# EAGLE design e14 (EAGLE 9.6.2)
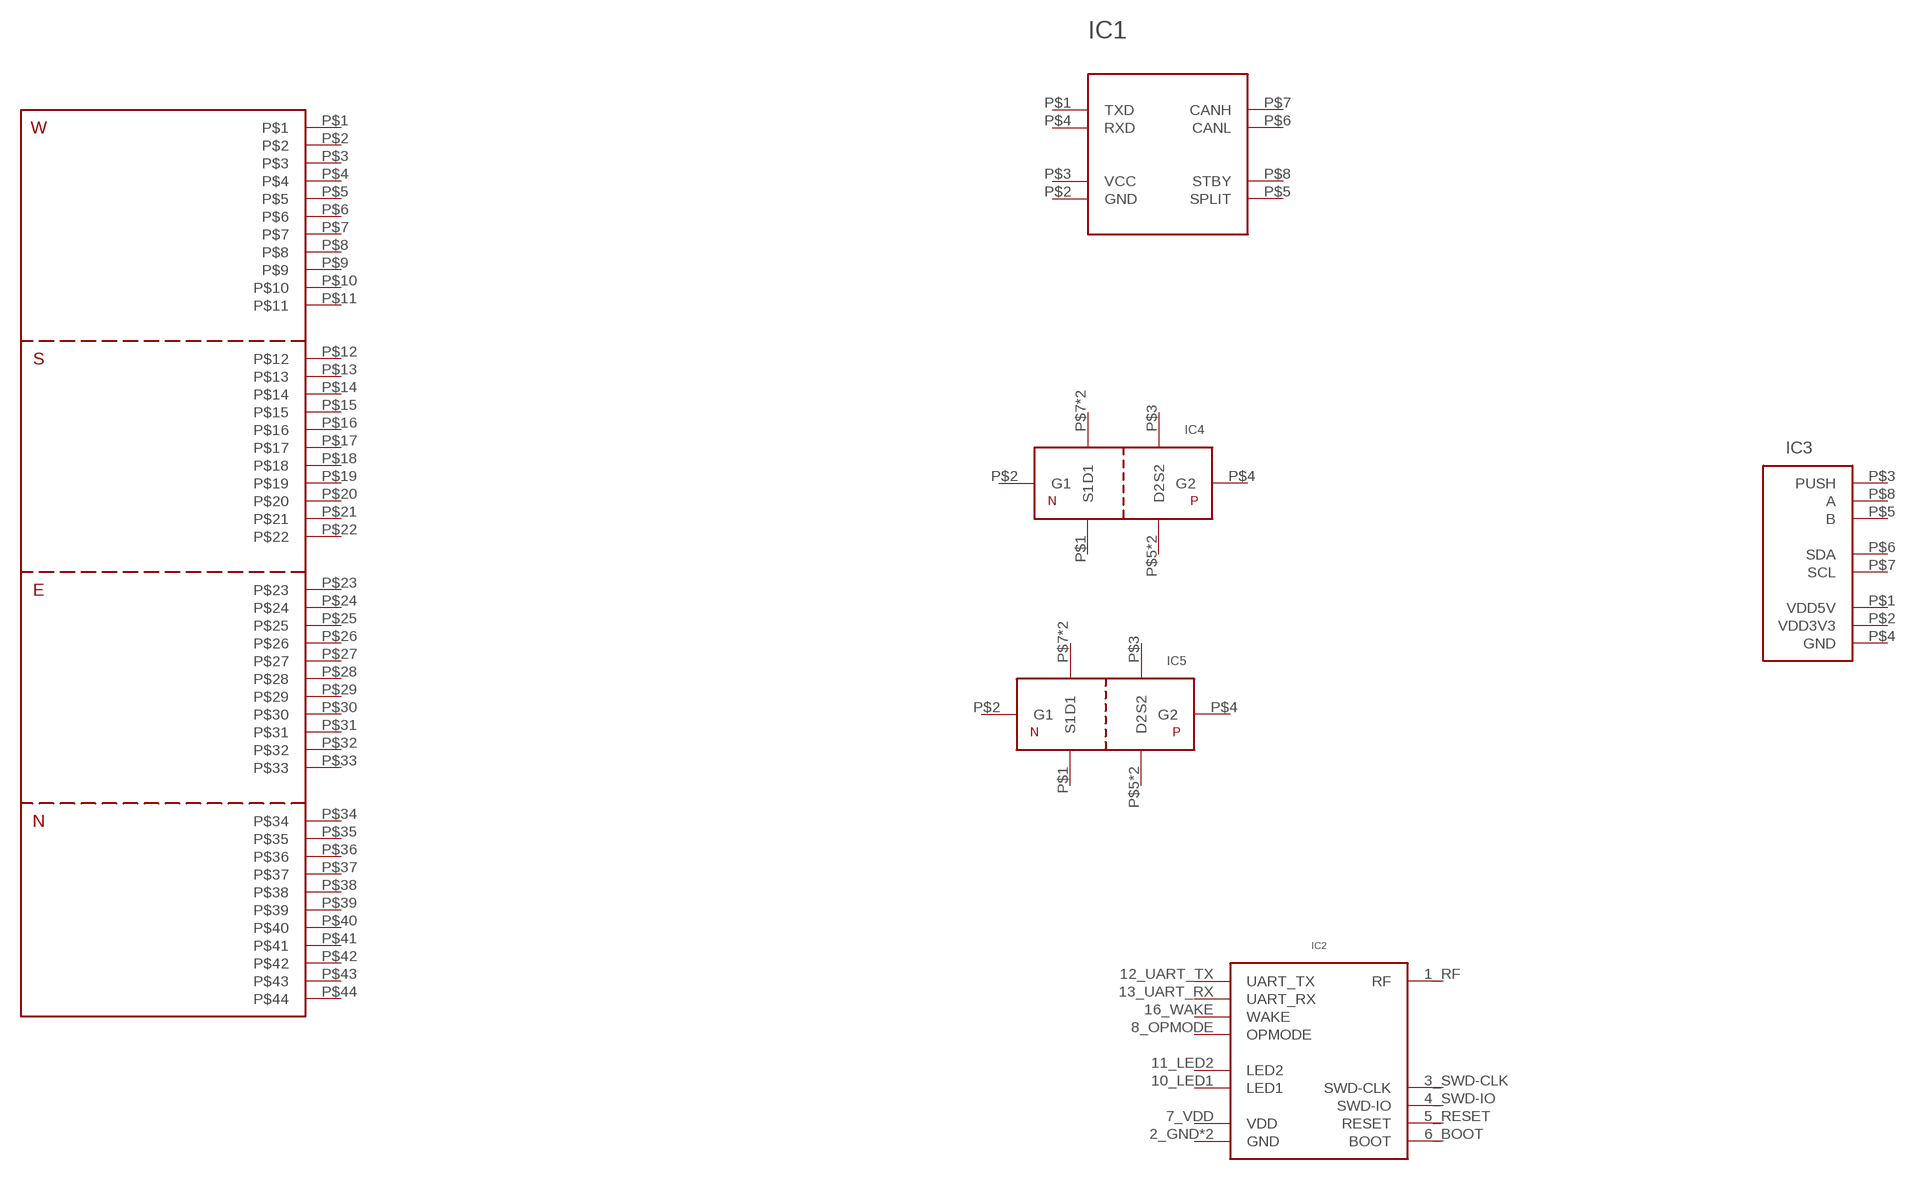
[diagram p0: schematic, sheet 1]

## Parts
IC1  MCP2561-2SOIC  [SOIC]
IC2  AMB2621  [SMD]
IC3  AS5601  [SOIC8]
IC4  4559A  [SO-8]
IC5  4559A  [SO-8]
IC6  PIC33  [QFN44]
Unconnected: IC1.P$1(TXD) IC1.P$4(RXD) IC1.P$5(SPLIT) IC1.P$6(CANL) IC1.P$7(CANH) IC1.P$8(STBY) IC2.1_RF(RF) IC2.3_SWD-CLK(SWD-CLK) IC2.4_SWD-IO(SWD-IO) IC2.5_RESET(RESET) IC2.6_BOOT(BOOT) IC2.8_OPMODE(OPMODE) IC2.10_LED1(LED1) IC2.11_LED2(LED2) IC2.12_UART_TX(UART_TX) IC2.13_UART_RX(UART_RX) IC2.16_WAKE(WAKE) IC3.P$3(PUSH) IC3.P$5(B) IC3.P$6(SDA) IC3.P$7(SCL) IC3.P$8(A) IC4.P$1(S1) IC4.P$2(G1) IC4.P$3(S2) IC4.P$4(G2) IC4.P$5(D2) IC4.P$6(D2) IC4.P$7(D1) IC4.P$8(D1) IC5.P$1(S1) IC5.P$2(G1) IC5.P$3(S2) IC5.P$4(G2) IC5.P$5(D2) IC5.P$6(D2) IC5.P$7(D1) IC5.P$8(D1) IC6.P$1 IC6.P$2 IC6.P$3 IC6.P$4 IC6.P$5 IC6.P$6 IC6.P$7 IC6.P$8 IC6.P$9 IC6.P$10 IC6.P$11 IC6.P$12 IC6.P$13 IC6.P$14 IC6.P$15 IC6.P$16 IC6.P$17 IC6.P$18 IC6.P$19 IC6.P$20 IC6.P$21 IC6.P$22 IC6.P$23 IC6.P$24 IC6.P$25 IC6.P$26 IC6.P$27 IC6.P$28 IC6.P$29 IC6.P$30 IC6.P$31 IC6.P$32 IC6.P$33 IC6.P$34 IC6.P$35 IC6.P$36 IC6.P$37 IC6.P$38 IC6.P$39 IC6.P$40 IC6.P$41 IC6.P$42 IC6.P$43 IC6.P$44

## Power pins joined to a net without a drawn wire
GND: IC1.P$2(GND) IC2.2_GND(GND) IC2.17_GND(GND) IC3.P$4(GND)
VCC: IC1.P$3(VCC)
VDD: IC2.7_VDD(VDD)
VDD3V3: IC3.P$2(VDD3V3)
VDD5V: IC3.P$1(VDD5V)

## Library data of the parts
IC1 = MCP2561-2 - High-Speed CAN Transceiver:MCP2561-2
IC2 = AMB2621 - BLE Module:AMB2621
IC3 = AS5601 - Programmable Contactless Encoder:AS5601
IC4 IC5 = 4559A - PN Fet:4559A
IC6 = PIC33:PIC33

## Net classes
2 Vcc: width 0.25 mm, drill 0.25 mm, clearance 0.25 mm

## Board
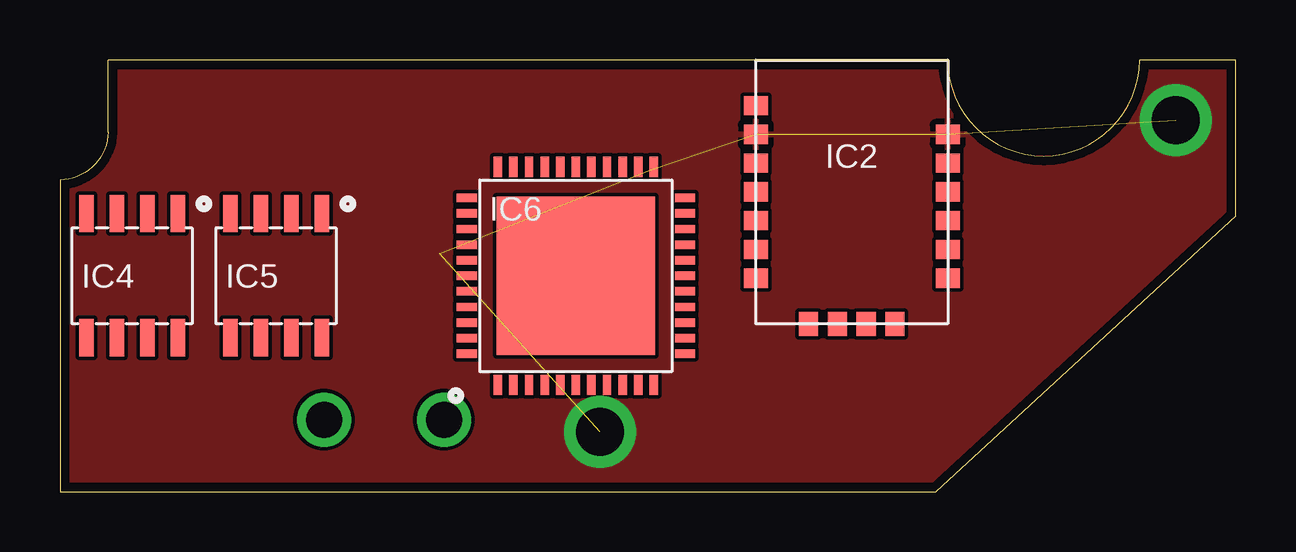
[diagram p1: board, top side]
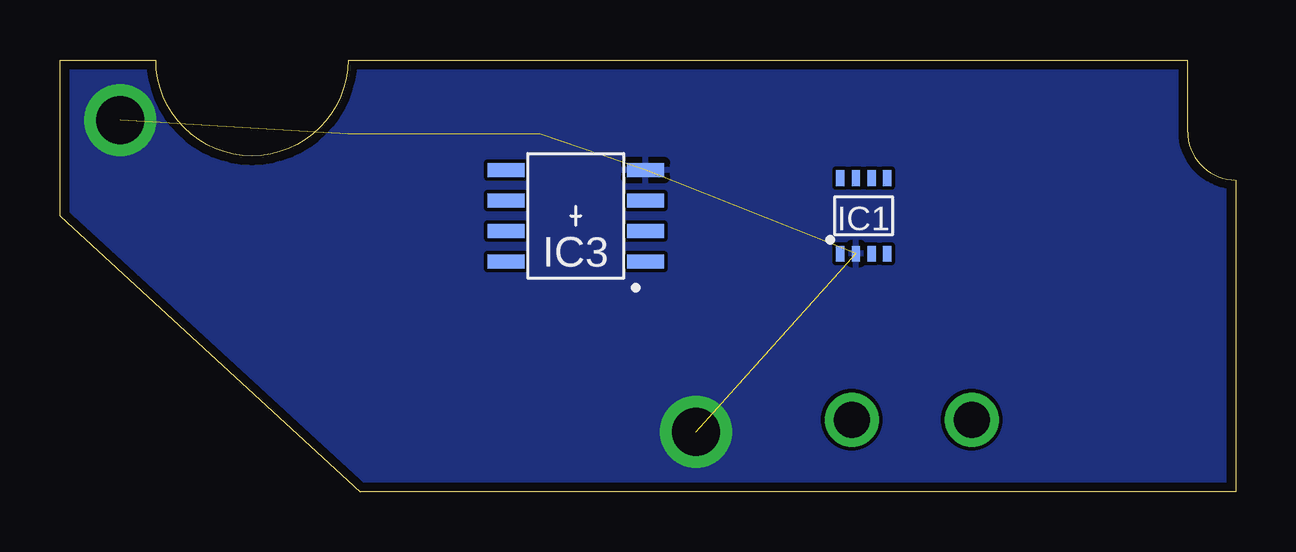
[diagram p2: board, bottom side, seen from below]

Size 49 x 18 mm. Coordinates in mm from the lower left corner, seen from the top.
Outline: 0,0 36.5,0 49,11.5 49,18 45,18 arc-180 37,18 2,18 2,15 arc-90 0,13 0,0
Copper layers (1*16): Top 0.035559375mm / dielectric 1.6mm / Bottom 0.035559375mm
Design rules "oshpark-2layer": minimum track width 6mil, minimum drill 10mil, track to track 6mil, track to pad 6mil, pad to pad 6mil, via to via 6mil, smd to smd 6mil, copper to edge 15mil, drill to drill 6mil, minimum pad ring 5mil, minimum via ring 5mil, stop-mask expansion 2.5mil, vias tented up to drill 0mil, thermal gap 10mil

### Footprints (pad centres in the part's own frame; a part is rotated, then mirrored left to right if it is on the bottom)
SOIC = smd 0.35 x 0.65: P$1 -0.975,-1.575; P$2 -0.325,-1.575; P$3 0.325,-1.575; P$4 0.975,-1.575; P$5 0.975,1.575; P$6 0.325,1.575; P$7 -0.325,1.575; P$8 -0.975,1.575
SMD = smd 1 x 0.8: 1_RF -4,4.1; 2_GND -4,2.9; 3_SWD-CLK -4,1.7; 4_SWD-IO -4,0.5; 5_RESET -4,-0.7; 6_BOOT -4,-1.9; 7_VDD -4,-3.1; 12_UART_TX 4,-3.1; 13_UART_RX 4,-1.9; 14_RESERVED 4,-0.7; 15_RESERVED 4,0.5; 16_WAKE 4,1.7; 17_GND 4,2.9 | smd 0.8 x 1: 8_OPMODE -1.8,-5; 9_RESERVED -0.6,-5; 10_LED1 0.6,-5; 11_LED2 1.8,-5
SOIC8 = smd 0.6 x 1.55: P$1 -1.905,-2.91; P$2 -0.635,-2.91; P$3 0.635,-2.91; P$4 1.905,-2.91; P$5 1.905,2.91; P$6 0.635,2.91; P$7 -0.635,2.91; P$8 -1.905,2.91
SO-8 = smd 0.6 x 1.55: P$1 -1.92,-2.6; P$2 -0.65,-2.6; P$3 0.62,-2.6; P$4 1.89,-2.6; P$5 1.89,2.58; P$6 0.62,2.58; P$7 -0.65,2.58; P$8 -1.92,2.58
QFN44 = smd 0.85 x 0.35: P$1 -4.55,3.25; P$2 -4.55,2.6; P$3 -4.55,1.95; P$4 -4.55,1.3; P$5 -4.55,0.65; P$6 -4.55,0; P$7 -4.55,-0.65; P$8 -4.55,-1.3; P$9 -4.55,-1.95; P$10 -4.55,-2.6; P$11 -4.55,-3.25; P$23 4.55,-3.25; P$24 4.55,-2.6; P$25 4.55,-1.95; P$26 4.55,-1.3; P$27 4.55,-0.65; P$28 4.55,0; P$29 4.55,0.65; P$30 4.55,1.3; P$31 4.55,1.95; P$32 4.55,2.6; P$33 4.55,3.25 | smd 0.35 x 0.85: P$12 -3.25,-4.55; P$13 -2.6,-4.55; P$14 -1.95,-4.55; P$15 -1.3,-4.55; P$16 -0.65,-4.55; P$17 0,-4.55; P$18 0.65,-4.55; P$19 1.3,-4.55; P$20 1.95,-4.55; P$21 2.6,-4.55; P$22 3.25,-4.55; P$34 3.25,4.55; P$35 2.6,4.55; P$36 1.95,4.55; P$37 1.3,4.55; P$38 0.65,4.55; P$39 0,4.55; P$40 -0.65,4.55; P$41 -1.3,4.55; P$42 -1.95,4.55; P$43 -2.6,4.55; P$44 -3.25,4.55 | smd 6.6 x 6.6: P$45 0,0

### Placement (x,y rotation side)
IC1  15.5,11.5 0 bottom
IC2  33,12 0 top
IC3  27.5,11.5 90 bottom
IC4  3,9 180 top
IC5  9,9 180 top
IC6  21.5,9 90 top

### Tracks (layer width: path | path; a pad name or v marks a point on that pad's centre or on a via)
GND  (via drill 2)  (5 unrouted)
  other vias: 22.5,2.5 46.5,15.5
  pour Top: -1,-1 50,-1 50,19 -1,19
  pour Bottom: -1,-1 50,-1 50,19 -1,19
MOTOR+  (via drill 1.5)
  other vias: 11,3
MOTOR-  (via drill 1.5)
  other vias: 16,3